# EAGLE design master_control_shield (EAGLE 5.11)
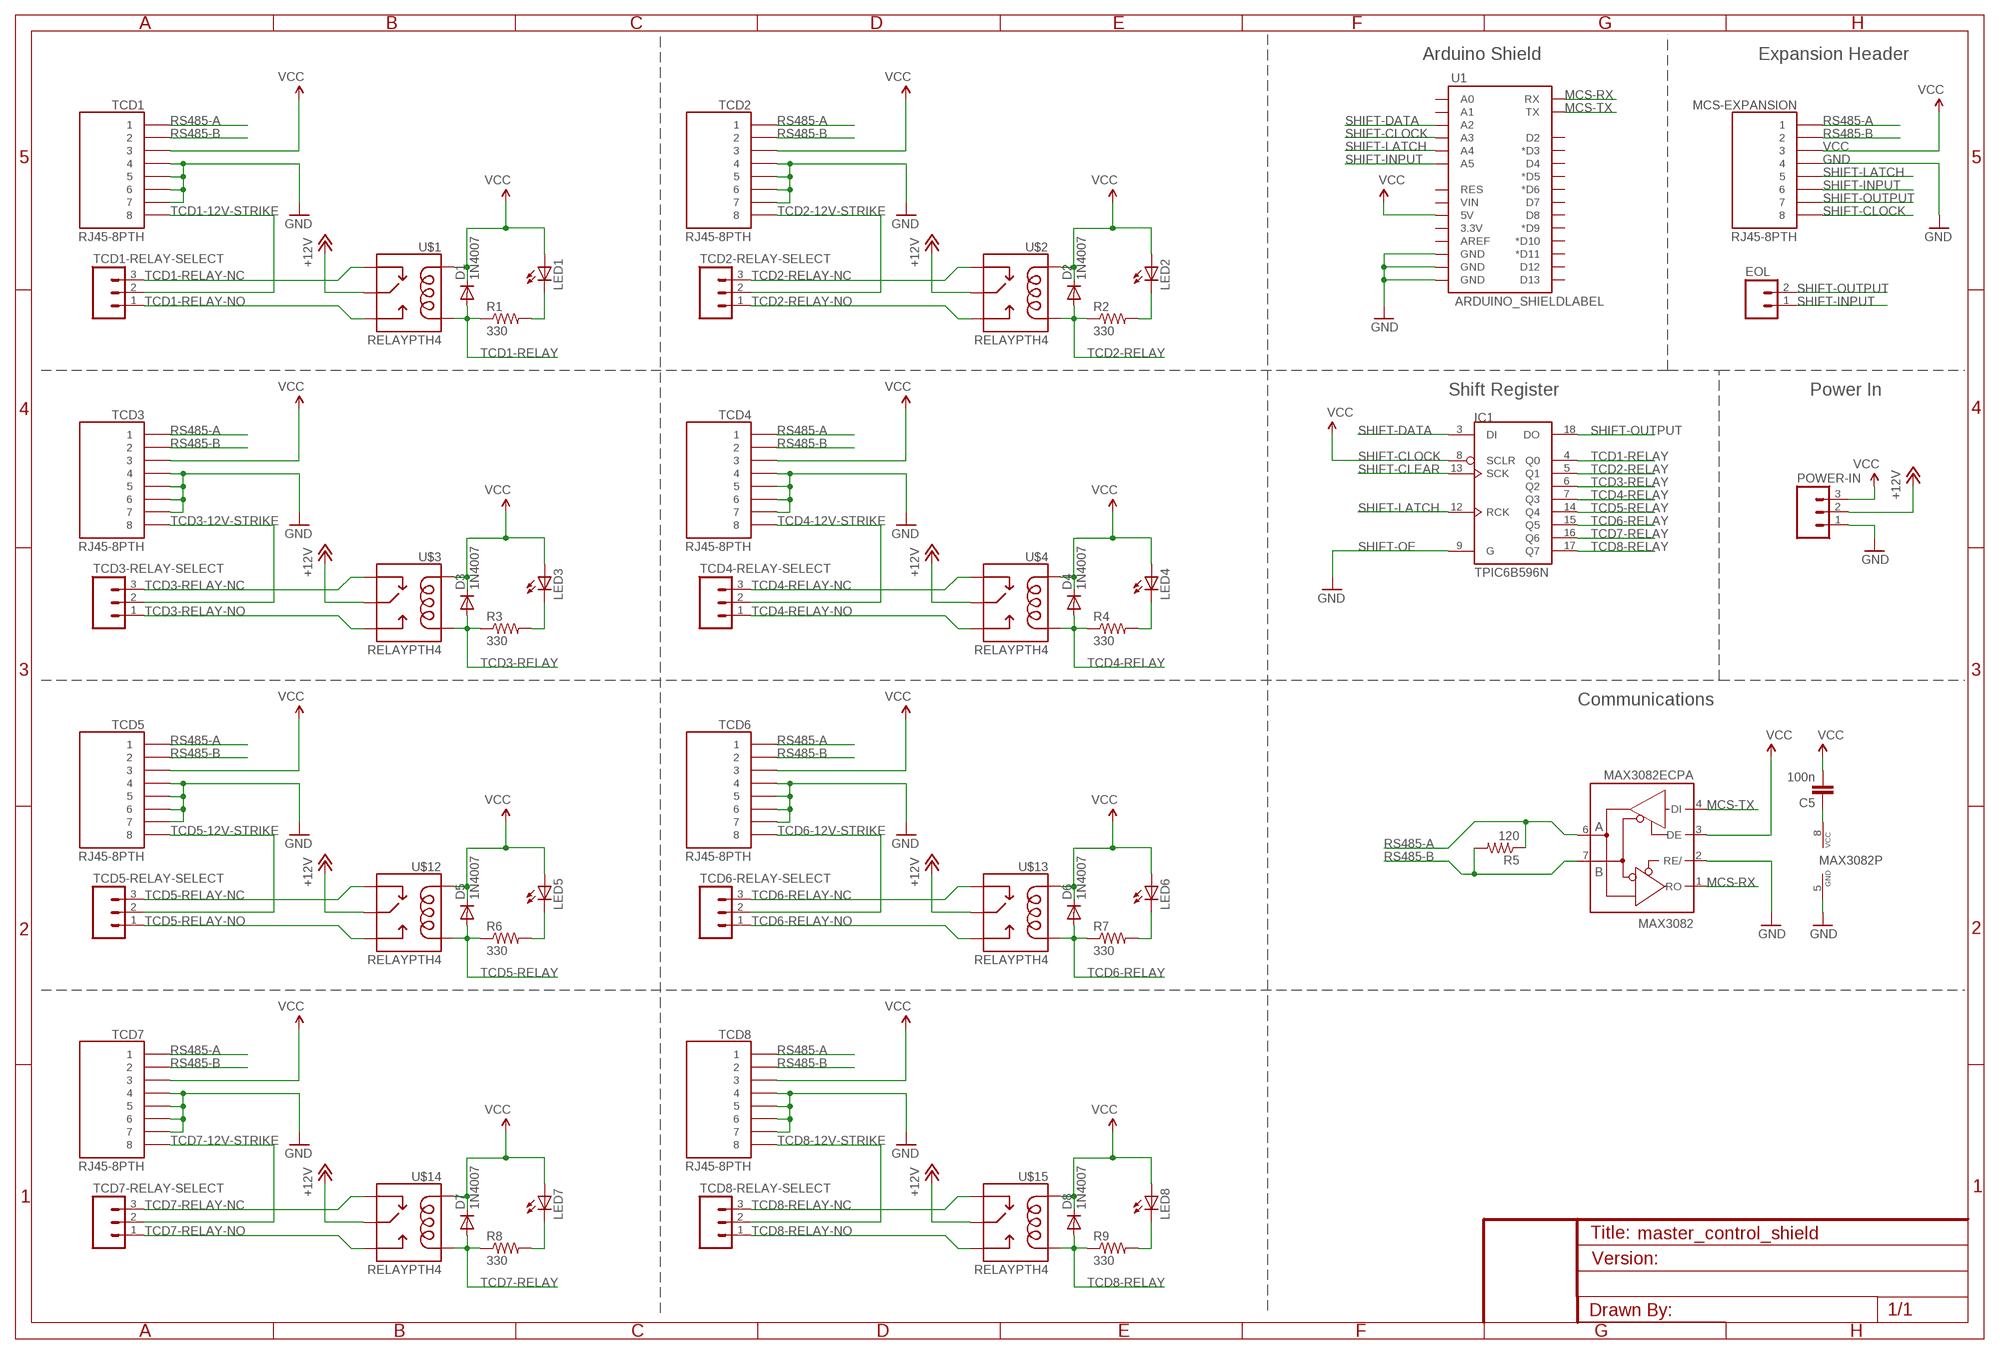
[diagram p0: schematic, sheet 1]

## Parts
C5  100n  CAPPTH  [CAP-PTH-SMALL]
D1  1N4007  DIODEPTH  [DIODE-1N4001]
D2  1N4007  DIODEPTH  [DIODE-1N4001]
D3  1N4007  DIODEPTH  [DIODE-1N4001]
D4  1N4007  DIODEPTH  [DIODE-1N4001]
D5  1N4007  DIODEPTH  [DIODE-1N4001]
D6  1N4007  DIODEPTH  [DIODE-1N4001]
D7  1N4007  DIODEPTH  [DIODE-1N4001]
D8  1N4007  DIODEPTH  [DIODE-1N4001]
EOL  M02PTH  [1X02]
IC1  TPIC6B596N  [DIL20]
LED1  LED5MM  [LED5MM]
LED2  LED5MM  [LED5MM]
LED3  LED5MM  [LED5MM]
LED4  LED5MM  [LED5MM]
LED5  LED5MM  [LED5MM]
LED6  LED5MM  [LED5MM]
LED7  LED5MM  [LED5MM]
LED8  LED5MM  [LED5MM]
MAX3082  MAX3082ECPA  MAX481CPA  [DIL08]
MCS-EXPANSION  RJ45-8PTH  [RJ45-8]
POWER-IN  M03SCREW  [SCREWTERMINAL-3.5MM-3]
R1  330  RESISTORPTH-1/4W  [AXIAL-0.4]
R2  330  RESISTORPTH-1/4W  [AXIAL-0.4]
R3  330  RESISTORPTH-1/4W  [AXIAL-0.4]
R4  330  RESISTORPTH-1/4W  [AXIAL-0.4]
R5  120  RESISTORPTH-1/4W  [AXIAL-0.4]
R6  330  RESISTORPTH-1/4W  [AXIAL-0.4]
R7  330  RESISTORPTH-1/4W  [AXIAL-0.4]
R8  330  RESISTORPTH-1/4W  [AXIAL-0.4]
R9  330  RESISTORPTH-1/4W  [AXIAL-0.4]
TCD1  RJ45-8PTH  [RJ45-8]
TCD1-RELAY-SELECT  M03PTH  [1X03]
TCD2  RJ45-8PTH  [RJ45-8]
TCD2-RELAY-SELECT  M03PTH  [1X03]
TCD3  RJ45-8PTH  [RJ45-8]
TCD3-RELAY-SELECT  M03PTH  [1X03]
TCD4  RJ45-8PTH  [RJ45-8]
TCD4-RELAY-SELECT  M03PTH  [1X03]
TCD5  RJ45-8PTH  [RJ45-8]
TCD5-RELAY-SELECT  M03PTH  [1X03]
TCD6  RJ45-8PTH  [RJ45-8]
TCD6-RELAY-SELECT  M03PTH  [1X03]
TCD7  RJ45-8PTH  [RJ45-8]
TCD7-RELAY-SELECT  M03PTH  [1X03]
TCD8  RJ45-8PTH  [RJ45-8]
TCD8-RELAY-SELECT  M03PTH  [1X03]
U1  ARDUINO_SHIELDLABEL  [DUEMILANOVE_SHIELD]
U$1  RELAYPTH4  [RELAY-JZC]
U$2  RELAYPTH4  [RELAY-JZC]
U$3  RELAYPTH4  [RELAY-JZC]
U$4  RELAYPTH4  [RELAY-JZC]
U$12  RELAYPTH4  [RELAY-JZC]
U$13  RELAYPTH4  [RELAY-JZC]
U$14  RELAYPTH4  [RELAY-JZC]
U$15  RELAYPTH4  [RELAY-JZC]

## Nets
+12V [signal]: POWER-IN.2 U$1.4(MAIN) U$2.4(MAIN) U$3.4(MAIN) U$4.4(MAIN) U$12.4(MAIN) U$13.4(MAIN) U$14.4(MAIN) U$15.4(MAIN)
GND: IC1.9(G) MAX3082.2(RE/) MAX3082.5(GND) MCS-EXPANSION.4 POWER-IN.1 TCD1.4 TCD1.5 TCD1.6 TCD1.7 TCD2.4 TCD2.5 TCD2.6 TCD2.7 TCD3.4 TCD3.5 TCD3.6 TCD3.7 TCD4.4 TCD4.5 TCD4.6 TCD4.7 TCD5.4 TCD5.5 TCD5.6 TCD5.7 TCD6.4 TCD6.5 TCD6.6 TCD6.7 TCD7.4 TCD7.5 TCD7.6 TCD7.7 TCD8.4 TCD8.5 TCD8.6 TCD8.7 U1.GND@0(GND) U1.GND@1(GND) U1.GND@2(GND)
MCS-RX: MAX3082.1(RO) U1.RX
MCS-TX: MAX3082.4(DI) U1.TX
N$1: LED1.K(C) R1.P$2
N$2: LED2.K(C) R2.P$2
N$3: LED3.K(C) R3.P$2
N$4: LED4.K(C) R4.P$2
N$5: LED5.K(C) R6.P$2
N$6: LED6.K(C) R7.P$2
N$7: LED7.K(C) R8.P$2
N$8: LED8.K(C) R9.P$2
N$14: C5.1 MAX3082.8(VCC)
RS485-A: MAX3082.6(A) MCS-EXPANSION.1 R5.P$1 TCD1.1 TCD2.1 TCD3.1 TCD4.1 TCD5.1 TCD6.1 TCD7.1 TCD8.1
RS485-B: MAX3082.7(B) MCS-EXPANSION.2 R5.P$2 TCD1.2 TCD2.2 TCD3.2 TCD4.2 TCD5.2 TCD6.2 TCD7.2 TCD8.2
SHIFT-CLOCK: IC1.13(SCK) MCS-EXPANSION.8 U1.A3
SHIFT-DATA: IC1.3(DI) U1.A2
SHIFT-INPUT: EOL.1 MCS-EXPANSION.6 U1.A5
SHIFT-LATCH: IC1.12(RCK) MCS-EXPANSION.5 U1.A4
SHIFT-OUTPUT: EOL.2 IC1.18(DO) MCS-EXPANSION.7
TCD1-12V-STRIKE: TCD1-RELAY-SELECT.2 TCD1.8
TCD1-RELAY: D1.A IC1.4(Q0) R1.P$1 U$1.1(COIL2)
TCD1-RELAY-NC: TCD1-RELAY-SELECT.3 U$1.2(NC)
TCD1-RELAY-NO: TCD1-RELAY-SELECT.1 U$1.3(NO)
TCD2-12V-STRIKE: TCD2-RELAY-SELECT.2 TCD2.8
TCD2-RELAY: D2.A IC1.5(Q1) R2.P$1 U$2.1(COIL2)
TCD2-RELAY-NC: TCD2-RELAY-SELECT.3 U$2.2(NC)
TCD2-RELAY-NO: TCD2-RELAY-SELECT.1 U$2.3(NO)
TCD3-12V-STRIKE: TCD3-RELAY-SELECT.2 TCD3.8
TCD3-RELAY: D3.A IC1.6(Q2) R3.P$1 U$3.1(COIL2)
TCD3-RELAY-NC: TCD3-RELAY-SELECT.3 U$3.2(NC)
TCD3-RELAY-NO: TCD3-RELAY-SELECT.1 U$3.3(NO)
TCD4-12V-STRIKE: TCD4-RELAY-SELECT.2 TCD4.8
TCD4-RELAY: D4.A IC1.7(Q3) R4.P$1 U$4.1(COIL2)
TCD4-RELAY-NC: TCD4-RELAY-SELECT.3 U$4.2(NC)
TCD4-RELAY-NO: TCD4-RELAY-SELECT.1 U$4.3(NO)
TCD5-12V-STRIKE: TCD5-RELAY-SELECT.2 TCD5.8
TCD5-RELAY: D5.A IC1.14(Q4) R6.P$1 U$12.1(COIL2)
TCD5-RELAY-NC: TCD5-RELAY-SELECT.3 U$12.2(NC)
TCD5-RELAY-NO: TCD5-RELAY-SELECT.1 U$12.3(NO)
TCD6-12V-STRIKE: TCD6-RELAY-SELECT.2 TCD6.8
TCD6-RELAY: D6.A IC1.15(Q5) R7.P$1 U$13.1(COIL2)
TCD6-RELAY-NC: TCD6-RELAY-SELECT.3 U$13.2(NC)
TCD6-RELAY-NO: TCD6-RELAY-SELECT.1 U$13.3(NO)
TCD7-12V-STRIKE: TCD7-RELAY-SELECT.2 TCD7.8
TCD7-RELAY: D7.A IC1.16(Q6) R8.P$1 U$14.1(COIL2)
TCD7-RELAY-NC: TCD7-RELAY-SELECT.3 U$14.2(NC)
TCD7-RELAY-NO: TCD7-RELAY-SELECT.1 U$14.3(NO)
TCD8-12V-STRIKE: TCD8-RELAY-SELECT.2 TCD8.8
TCD8-RELAY: D8.A IC1.17(Q7) R9.P$1 U$15.1(COIL2)
TCD8-RELAY-NC: TCD8-RELAY-SELECT.3 U$15.2(NC)
TCD8-RELAY-NO: TCD8-RELAY-SELECT.1 U$15.3(NO)
VCC: C5.2 D1.C D2.C D3.C D4.C D5.C D6.C D7.C D8.C IC1.8(SCLR) LED1.A LED2.A LED3.A LED4.A LED5.A LED6.A LED7.A LED8.A MAX3082.3(DE) MCS-EXPANSION.3 POWER-IN.3 TCD1.3 TCD2.3 TCD3.3 TCD4.3 TCD5.3 TCD6.3 TCD7.3 TCD8.3 U1.5V U$1.5(COIL1) U$2.5(COIL1) U$3.5(COIL1) U$4.5(COIL1) U$12.5(COIL1) U$13.5(COIL1) U$14.5(COIL1) U$15.5(COIL1)
Unconnected: U1.3.3V U1.A0 U1.A1 U1.AREF U1.D2 U1.D3(*D3) U1.D4 U1.D5(*D5) U1.D6(*D6) U1.D7 U1.D8 U1.D9(*D9) U1.D10(*D10) U1.D11(*D11) U1.D12 U1.D13 U1.RES U1.VIN

## Notes on the sheet
- Arduino Shield | Expansion Header
- Shift Register | Power In
- SHIFT-CLEAR
- SHIFT-OE
- Communications

## Power pins joined to a net without a drawn wire
GND: IC1.10(GND) IC1.11(GND) IC1.19(GND)
VCC: IC1.2(VCC)

## Library data of the parts
C5 = SparkFun:CAP: Capacitor Standard 0603 ceramic capacitor, and 0.1" leaded capacitor.
D1-D8 = SparkFun:DIODE: Diode These are standard reverse protection diodes and small signal diodes. SMA package can handle up to about 1A. SOD-323 can handle about 200mA. What the SOD-323 package when ordering, there are some mfgs out there that are 5-pin packages.
EOL = SparkFun:M02: Header 2 Standard 2-pin 0.1" header. Use with straight break away headers (SKU : PRT-00116), right angle break away headers (PRT-00553), swiss pins (PRT-00743), machine pins (PRT-00117), and female headers (PRT-00115). Molex polarized connector foot print use with SKU : PRT-08233 with associated crimp pins and housings.
IC1 = tpic:TPIC6B596
LED1-LED8 = SparkFun:LED: LEDs Standard schematic elements and footprints for 5mm, 3mm, 1206, and 0603 sized LEDs. 5mm - Spark Fun Electronics SKU : COM-00529 (and others)
MAX3082 = maxim:MAX481CPA: RS485 TRANSEIVER; MPN: MAX481CPA+; OC_FARNELL: unknown; OC_NEWARK: 99K3445
MCS-EXPANSION TCD1-TCD8 = SparkFun:RJ45-8: RJ45 Jack Simple RJ45, 8-pin connection - connector for common Cat5, Cat5e, and Cat6 Ethernet cables. Footprint not yet proven in production. Connector sku is PRT-00643; Breakout PCB sku is BOB-00716.
POWER-IN TCD1-RELAY-SELECT TCD2-RELAY-SELECT TCD3-RELAY-SELECT TCD4-RELAY-SELECT TCD5-RELAY-SELECT TCD6-RELAY-SELECT TCD7-RELAY-SELECT TCD8-RELAY-SELECT = SparkFun:M03: Header 3 Standard 3-pin 0.1" header. Use with straight break away headers (SKU : PRT-00116), right angle break away headers (PRT-00553), swiss pins (PRT-00743), machine pins (PRT-00117), and female headers (PRT-00115). Molex polarized connector foot print use with SKU : PRT-08232 with associated crimp pins and housings.
R1-R9 = SparkFun:RESISTOR: Resistor Basic schematic elements and footprints for 0603, 1206, and PTH resistors.
U1 = SparkFun:ARDUINO_SHIELD
U$1-U$4 U$12-U$15 = SparkFun:RELAY

## Net classes
1 power: width 0.61 mm, clearance 0.406 mm
2 signal: width 0.406 mm, clearance 0.305 mm
3 ground: width 0.406 mm, drill 0.127 mm, clearance 0.254 mm to class 0, clearance 0.254 mm to class 1, clearance 0.254 mm to class 2

## Board
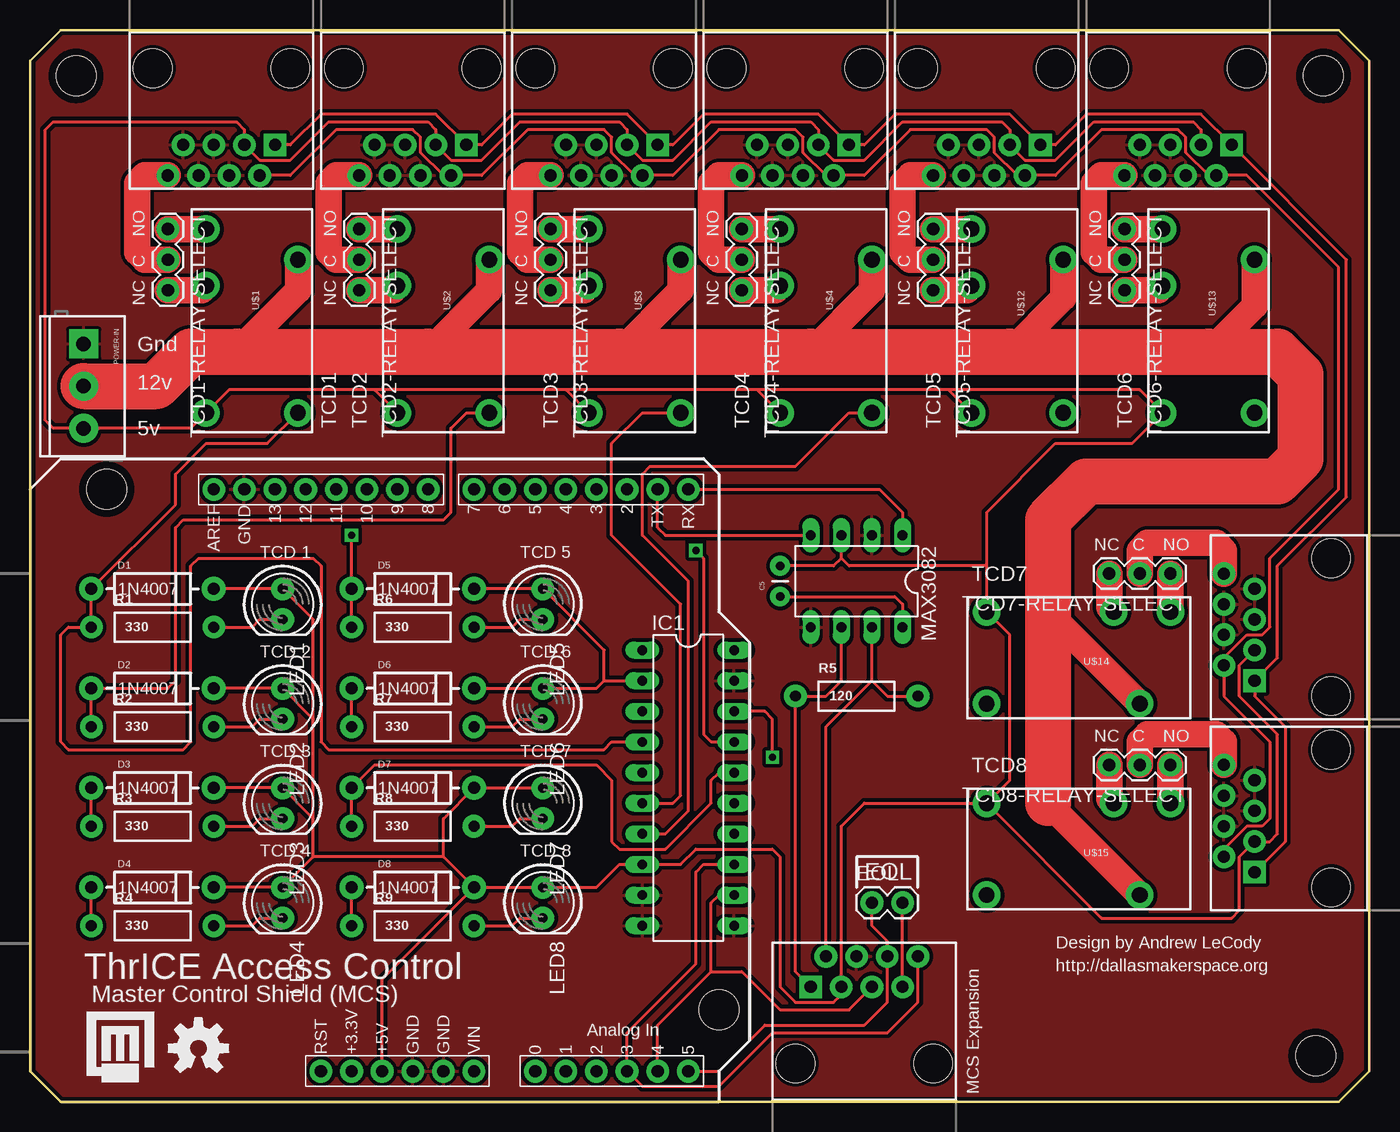
[diagram p1: board, top side]
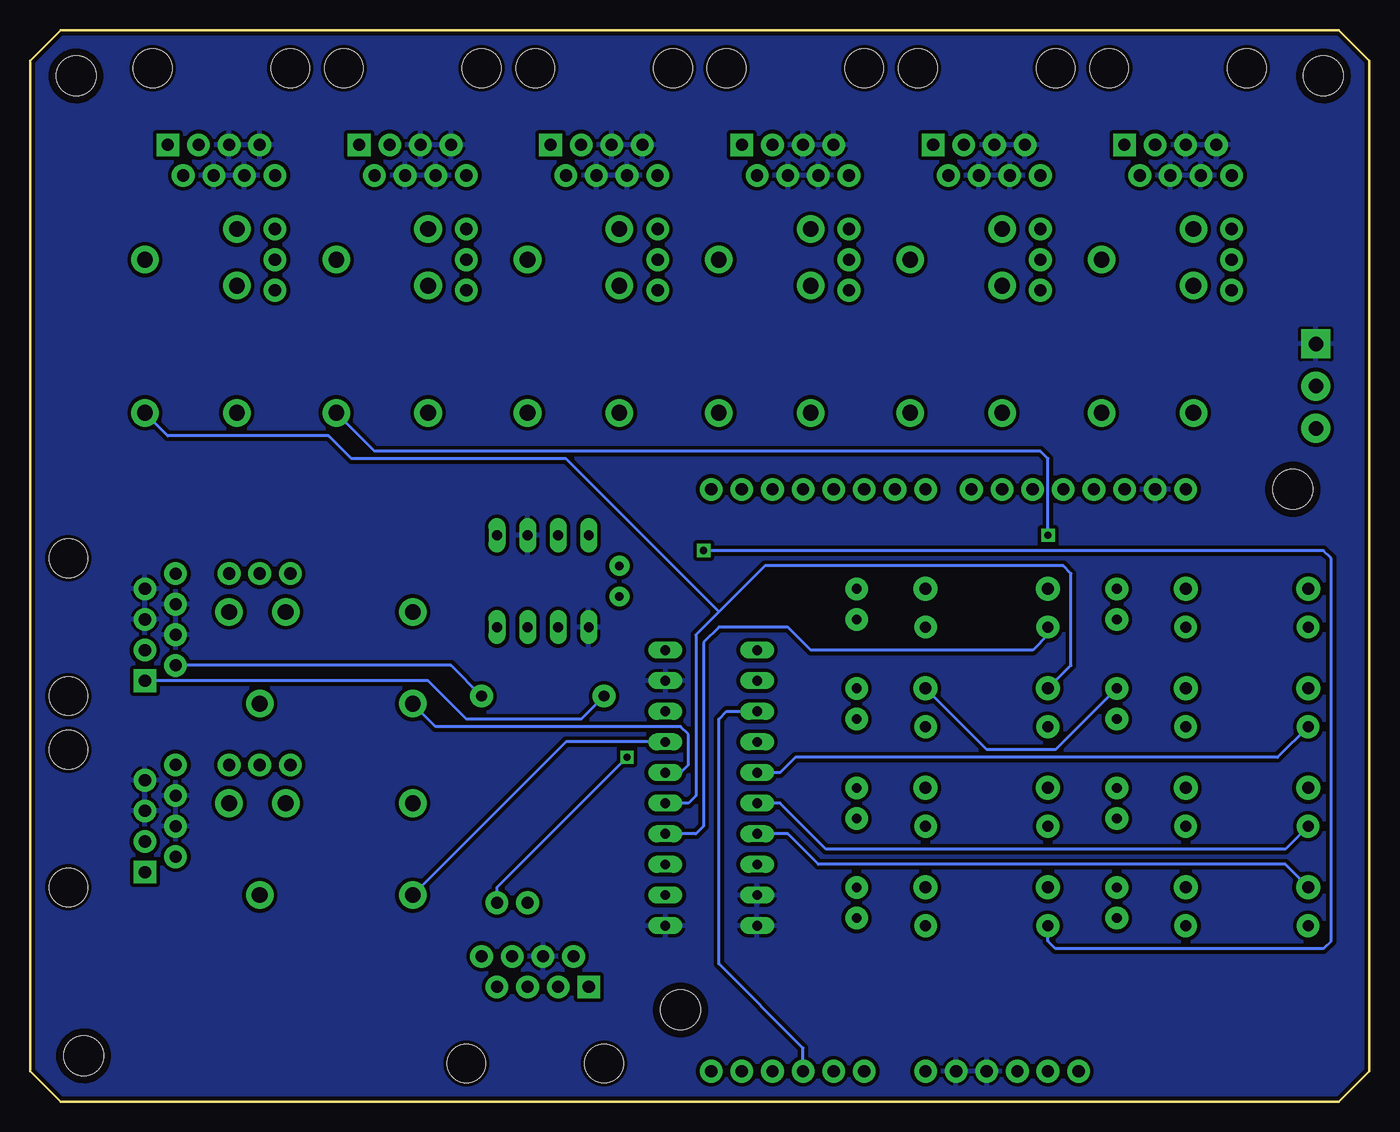
[diagram p2: board, bottom side, seen from below]

Size 111.12 x 88.89 mm. Coordinates in mm from the lower left corner, seen from the top.
Outline: 2.54,0 108.58,0 111.12,2.54 111.12,86.36 108.58,88.89 2.53,88.89 0,86.36 0,2.54 2.54,0
Copper layers (1*16): Top 0.035mm / dielectric 1.5mm / Bottom 0.035mm
Design rules "SparkFun": minimum track width 8mil, minimum drill 20mil, track to track 8mil, track to pad 8mil, pad to pad 8mil, via to via 8mil, smd to smd 8mil, copper to edge 10mil, drill to drill 8mil, minimum pad ring 12mil, minimum via ring 10mil, stop-mask expansion 4mil, vias tented up to drill 25mil, thermal gap 10mil

### Footprints (pad centres in the part's own frame; a part is rotated, then mirrored left to right if it is on the bottom)
CAP-PTH-SMALL = drill 0.7 pad 1.651 round: 1 0,0; 2 2.54,0
DIODE-1N4001 = drill 1 pad 1.981 round: A -5.08,0; C 5.08,0
1X02 = drill 1.016 pad 1.88 round: 1 0,0; 2 2.54,0
DIL20 = drill 0.813 long: 1 -11.43,-3.81; 2 -8.89,-3.81; 3 -6.35,-3.81; 4 -3.81,-3.81; 5 -1.27,-3.81; 6 1.27,-3.81; 7 3.81,-3.81; 8 6.35,-3.81; 9 8.89,-3.81; 10 11.43,-3.81; 11 11.43,3.81; 12 8.89,3.81; 13 6.35,3.81; 14 3.81,3.81; 15 1.27,3.81; 16 -1.27,3.81; 17 -3.81,3.81; 18 -6.35,3.81; 19 -8.89,3.81; 20 -11.43,3.81
LED5MM = drill 0.813 pad 1.88 round: A -1.27,0; K 1.27,0
DIL08 = drill 0.813 long: 1 -3.81,-3.81; 2 -1.27,-3.81; 3 1.27,-3.81; 4 3.81,-3.81; 5 3.81,3.81; 6 1.27,3.81; 7 -1.27,3.81; 8 -3.81,3.81
RJ45-8 = drill 1 pad 1.88 square: 1 -4.445,6.35 | drill 1 pad 1.88 round: 2 -3.175,8.89; 3 -1.905,6.35; 4 -0.635,8.89; 5 0.635,6.35; 6 1.905,8.89; 7 3.175,6.35; 8 4.445,8.89 | hole 3.2: -5.715,0; 5.715,0
SCREWTERMINAL-3.5MM-3 = drill 1.2 pad 2.413 square: 1 0,0 | drill 1.2 pad 2.413 round: 2 3.5,0; 3 7,0
AXIAL-0.4 = drill 0.9 pad 1.88 round: P$1 -5.08,0; P$2 5.08,0
1X03 = drill 1.016 pad 1.88 round: 1 0,0; 2 2.54,0; 3 5.08,0
DUEMILANOVE_SHIELD = drill 1.016 pad 1.88 round: 3.3V 50.8,26.67; 5V 50.8,29.21; A0 50.8,41.91; A1 50.8,44.45; A2 50.8,46.99; A3 50.8,49.53; A4 50.8,52.07; A5 50.8,54.61; AREF 2.54,15.24; D2 2.54,49.53; D3 2.54,46.99; D4 2.54,44.45; D5 2.54,41.91; D6 2.54,39.37; D7 2.54,36.83; D8 2.54,33.02; D9 2.54,30.48; D10 2.54,27.94; D11 2.54,25.4; D12 2.54,22.86; D13 2.54,20.32; GND@0 50.8,31.75; GND@1 50.8,34.29; GND@2 2.54,17.78; RES 50.8,24.13; RX 2.54,54.61; TX 2.54,52.07; VIN 50.8,36.83 | hole 3.302: 45.72,57.15; 2.54,6.35
RELAY-JZC = drill 1.3 pad 2.286 round: 1 3.81,-8.89; 2 -3.81,1.651; 3 -3.81,6.35; 4 3.81,3.81; 5 -3.81,-8.89
STAND-OFF = hole 3.302: 0,0

### Placement (x,y rotation side)
C5  62.23,41.91 90 top
D1  10.16,42.55 0 top
D2  10.16,34.29 0 top
D3  10.16,26.04 0 top
D4  10.16,17.78 0 top
D5  31.75,42.55 0 top
D6  31.75,34.29 0 top
D7  31.75,26.04 0 top
D8  31.75,17.78 0 top
EOL  69.85,16.51 0 top
IC1  54.61,26.04 270 top
LED1  20.95,41.27 270 top
LED2  20.95,33.02 270 top
LED3  20.95,24.77 270 top
LED4  20.95,16.51 270 top
LED5  42.55,41.27 270 top
LED6  42.55,33.02 270 top
LED7  42.55,24.77 270 top
LED8  42.55,16.51 270 top
MAX3082  68.58,43.18 180 top
MCS-EXPANSION  69.22,3.17 0 top
POWER-IN  4.45,62.87 270 top
R1  10.16,39.37 0 top
R2  10.16,31.11 0 top
R3  10.16,22.86 0 top
R4  10.16,14.61 0 top
R5  68.58,33.66 0 top
R6  31.75,39.37 0 top
R7  31.75,31.11 0 top
R8  31.75,22.86 0 top
R9  31.75,14.61 0 top
TCD1  15.88,85.72 180 top
TCD1-RELAY-SELECT  11.43,72.39 270 top
TCD2  31.75,85.72 180 top
TCD2-RELAY-SELECT  27.3,72.39 270 top
TCD3  47.62,85.72 180 top
TCD3-RELAY-SELECT  43.18,72.39 270 top
TCD4  63.5,85.72 180 top
TCD4-RELAY-SELECT  59.05,72.39 270 top
TCD5  79.38,85.72 180 top
TCD5-RELAY-SELECT  74.93,72.39 270 top
TCD6  95.25,85.72 180 top
TCD6-RELAY-SELECT  90.81,72.39 270 top
TCD7  107.95,39.37 90 top
TCD7-RELAY-SELECT  94.61,43.81 180 top
TCD8  107.95,23.5 90 top
TCD8-RELAY-SELECT  94.61,27.94 180 top
U1  0,53.34 270 top
U$1  18.41,66.04 0 top
U$2  34.29,66.04 0 top
U$3  50.16,66.04 0 top
U$4  66.04,66.04 0 top
U$5  [STAND-OFF]  3.81,85.09 0 top
U$6  [STAND-OFF]  107.31,85.09 0 top
U$7  [STAND-OFF]  106.68,3.81 0 top
U$8  [DMS-LOGO]  4.45,1.27 0 top
U$11  [OSHW-LOGO-M]  13.97,4.45 0 top
U$12  81.92,66.04 0 top
U$13  97.79,66.04 0 top
U$14  88.27,36.83 270 top
U$15  88.27,20.95 270 top

### Tracks (layer width: path | path; a pad name or v marks a point on that pad's centre or on a via)
+12V
  Top 2.184: U$13.4 101.6,66.04 97.79,62.23 | U$12.4 85.72,66.67 81.28,62.23 | U$1.4 22.23,67.31 17.14,62.23 | U$4.4 69.85,67.31 64.77,62.23 | U$3.4 53.98,67.31 48.9,62.23 | U$2.4 38.1,67.31 33.02,62.23 | 84.45,24.77 U$15.4 | 84.45,40.64 U$14.4
  Top 3.81: POWER-IN.2 10.47,59.37 13.34,62.23 17.14,62.23 33.02,62.23 48.9,62.23 64.77,62.23 81.28,62.23 97.79,62.23 103.5,62.23 105.41,60.33 105.41,53.34 103.5,51.44 87.63,51.44 84.45,48.26 84.45,40.64 84.45,24.77
GND
  pour Bottom (isolate 0.305): -1.91,90.81 113.03,90.81 113.03,-1.91 -1.91,-1.91
  pour Top (isolate 0.305): -3.81,92.71 115.57,92.71 115.57,-3.81 -3.81,-3.81
MCS-RX
  Top 0.254: MAX3082.1 72.39,48.9 70.48,50.8 U1.RX
MCS-TX
  Top 0.254: MAX3082.4 52.7,46.99 52.07,47.62 U1.TX
N$1
  Top 0.254: LED1.K 19.05,40.01 18.41,39.37 R1.P$2
N$2
  Top 0.254: LED2.K 19.05,31.75 18.41,31.11 R2.P$2
N$3
  Top 0.254: LED3.K 19.05,23.5 18.41,22.86 R3.P$2
N$4
  Top 0.254: LED4.K 19.05,15.24 18.41,14.61 R4.P$2
N$5
  Top 0.254: LED5.K 40.64,40.01 40.01,39.37 R6.P$2
N$6
  Top 0.254: LED6.K 40.64,31.75 40.01,31.11 R7.P$2
N$7
  Top 0.254: LED7.K 40.64,23.5 40.01,22.86 R8.P$2
N$8
  Top 0.254: LED8.K 40.64,15.24 40.01,14.61 R9.P$2
N$14
  Top 0.254: C5.1 71.75,41.91 72.39,41.27 MAX3082.8
RS485-A
  Top 0.254: MAX3082.6 67.31,34.92 66.04,33.66 R5.P$1 63.5,10.79 MCS-EXPANSION.1 | TCD1.1 21.59,79.38 24.13,81.92 33.66,81.92 TCD2.1 37.47,79.38 40.01,81.92 49.53,81.92 TCD3.1 53.34,79.38 55.88,81.92 65.41,81.92 TCD4.1 69.22,79.38 71.75,81.92 81.28,81.92 TCD5.1 85.09,79.38 87.63,81.92 97.16,81.92 TCD6.1 109.22,69.85 109.22,50.16 103.5,44.45 103.5,36.83 TCD7.1 101.6,33.66 104.14,31.11 104.14,21.59 TCD8.1
  Bottom 0.254: TCD7.1 78.11,34.92 74.93,31.75 65.41,31.75 R5.P$1
RS485-B
  Top 0.254: 69.85,34.92 MAX3082.7 | TCD1.2 21.59,76.83 25.4,80.64 31.75,80.64 32.38,80.01 32.38,78.74 34.29,76.83 TCD2.2 37.47,76.83 41.27,80.64 47.62,80.64 48.26,80.01 48.26,78.74 50.16,76.83 TCD3.2 53.34,76.83 57.15,80.64 63.5,80.64 64.14,80.01 64.14,78.74 66.04,76.83 TCD4.2 69.22,76.83 73.03,80.64 79.38,80.64 80.01,80.01 80.01,78.74 81.92,76.83 TCD5.2 85.09,76.83 88.9,80.64 95.25,80.64 95.89,80.01 95.89,78.74 97.79,76.83 TCD6.2 100.97,76.83 108.58,69.22 108.58,50.8 102.87,45.09 102.87,39.37 102.23,38.73 100.97,38.73 99.06,36.83 TCD7.2 99.06,33.66 102.87,29.84 102.87,23.5 102.23,22.86 100.97,22.86 99.06,20.95 TCD8.2 | MCS-EXPANSION.2 66.04,31.11 69.85,34.92 | R5.P$2 71.12,33.66 69.85,34.92
  Bottom 0.254: R5.P$2 76.2,36.2 TCD7.2
SHIFT-CLOCK
  Top 0.254: IC1.13 55.88,19.68 55.24,19.05 55.24,11.43 49.53,5.71 U1.A3 50.8,1.27 57.15,1.27 61.59,5.71 71.12,5.71 73.66,8.26 MCS-EXPANSION.8
SHIFT-DATA
  Bottom 0.254: U1.A2 46.99,4.45 53.98,11.43 53.98,31.75 53.34,32.38 IC1.3
SHIFT-INPUT
  Top 0.254: U1.A5 57.15,2.54 60.96,6.35 69.22,6.35 71.12,8.26 MCS-EXPANSION.6 71.12,13.34 69.85,14.61 EOL.1
SHIFT-LATCH
  Top 0.254: U1.A4 52.07,6.35 56.52,10.79 | 56.52,10.79 59.05,10.79 62.23,7.62 67.94,7.62 MCS-EXPANSION.5 | IC1.12 57.15,17.14 56.52,16.51 56.52,10.79
SHIFT-OUTPUT  (via drill 0.6)
  Top 0.254: MCS-EXPANSION.7 EOL.2 | v61.59,28.57 61.59,31.75 60.96,32.38 IC1.18
  Bottom 0.254: EOL.2 72.39,17.78 v61.59,28.57
TCD1-12V-STRIKE
  Top 2.184: TCD1-RELAY-SELECT.2 9.53,69.85 8.89,70.48 8.89,76.2 9.53,76.83 TCD1.8
TCD1-RELAY
  Top 0.254: U$1.1 19.68,54.61 14.61,54.61 12.06,52.07 12.06,49.53 D1.A R1.P$1 3.17,39.37 2.54,38.73 2.54,29.84 3.17,29.21 12.7,29.21 13.34,29.84 13.34,44.45 13.97,45.09 23.5,45.09 24.13,44.45 24.13,29.84 24.77,29.21 47.62,29.21 48.26,29.84 IC1.4
TCD1-RELAY-NC
  Top 2.184: TCD1-RELAY-SELECT.3 14.22,67.31 U$1.2
TCD1-RELAY-NO
  Top 2.184: TCD1-RELAY-SELECT.1 U$1.3
TCD2-12V-STRIKE
  Top 2.184: TCD2-RELAY-SELECT.2 25.4,69.85 24.77,70.48 24.77,76.2 25.4,76.83 TCD2.8
TCD2-RELAY
  Top 0.254: R2.P$1 D2.A 11.43,34.29 12.06,34.92 12.06,47.62 12.7,48.26 34.29,48.26 34.92,48.9 34.92,55.88 36.2,57.15 U$2.1
  Bottom 0.254: IC1.5 48.9,27.3 47.62,28.57 7.62,28.57 R2.P$1
TCD2-RELAY-NC
  Top 2.184: TCD2-RELAY-SELECT.3 30.1,67.31 U$2.2
TCD2-RELAY-NO
  Top 2.184: TCD2-RELAY-SELECT.1 U$2.3
TCD3-12V-STRIKE
  Top 2.184: TCD3-RELAY-SELECT.2 41.27,69.85 40.64,70.48 40.64,76.2 41.27,76.83 TCD3.8
TCD3-RELAY
  Top 0.254: R3.P$1 D3.A | IC1.6 53.34,24.77 53.98,25.4 53.98,41.27 48.26,46.99 48.26,54.61 50.8,57.15 U$3.1
  Bottom 0.254: IC1.6 48.9,24.77 45.09,20.95 6.99,20.95 R3.P$1
TCD3-RELAY-NC
  Top 2.184: TCD3-RELAY-SELECT.3 45.97,67.31 U$3.2
TCD3-RELAY-NO
  Top 2.184: TCD3-RELAY-SELECT.1 U$3.3
TCD4-12V-STRIKE
  Top 2.184: TCD4-RELAY-SELECT.2 57.15,69.85 56.52,70.48 56.52,76.2 57.15,76.83 TCD4.8
TCD4-RELAY
  Top 0.254: R4.P$1 D4.A | IC1.7 52.7,22.23 54.61,24.13 54.61,43.18 50.8,46.99 50.8,52.07 51.44,52.7 63.5,52.7 67.94,57.15 U$4.1
  Bottom 0.254: IC1.7 48.26,22.23 45.72,19.68 6.99,19.68 D4.A
TCD4-RELAY-NC
  Top 2.184: TCD4-RELAY-SELECT.3 61.85,67.31 U$4.2
TCD4-RELAY-NO
  Top 2.184: TCD4-RELAY-SELECT.1 U$4.3
TCD5-12V-STRIKE
  Top 2.184: TCD5-RELAY-SELECT.2 73.03,69.85 72.39,70.48 72.39,76.2 73.03,76.83 TCD5.8
TCD5-RELAY  (via drill 0.6)
  Top 0.254: R6.P$1 D5.A v26.67,46.99
  Bottom 0.254: R6.P$1 26.67,38.73 27.94,37.47 46.35,37.47 48.26,39.37 53.98,39.37 55.24,38.1 55.24,22.86 55.88,22.23 IC1.14 | v26.67,46.99 26.67,53.34 27.3,53.98 82.55,53.98 U$12.1
TCD5-RELAY-NC
  Top 2.184: TCD5-RELAY-SELECT.3 77.72,67.31 U$12.2
TCD5-RELAY-NO
  Top 2.184: TCD5-RELAY-SELECT.1 U$12.3
TCD6-12V-STRIKE
  Top 2.184: TCD6-RELAY-SELECT.2 88.9,69.85 88.27,70.48 88.27,76.2 88.9,76.83 TCD6.8
TCD6-RELAY
  Top 0.254: R7.P$1 D6.A
  Bottom 0.254: IC1.15 56.52,24.77 55.88,25.4 55.88,38.73 53.98,40.64 | 53.98,40.64 50.16,44.45 25.4,44.45 24.77,43.81 24.77,36.2 D6.A | 53.98,40.64 66.67,53.34 84.45,53.34 86.36,55.24 99.69,55.24 U$13.1
TCD6-RELAY-NC
  Top 2.184: TCD6-RELAY-SELECT.3 93.6,67.31 U$13.2
TCD6-RELAY-NO
  Top 2.184: TCD6-RELAY-SELECT.1 U$13.3
TCD7-12V-STRIKE
  Top 2.184: TCD7-RELAY-SELECT.2 92.08,45.72 92.71,46.35 98.42,46.35 99.06,45.72 TCD7.8
TCD7-RELAY
  Top 0.254: R8.P$1 D7.A 28.57,27.94 46.99,27.94 48.26,26.67 48.26,21.59 48.9,20.95 52.7,20.95 56.52,24.77 56.52,26.67 57.15,27.3 IC1.16
  Bottom 0.254: U$14.1 77.47,31.11 57.15,31.11 56.52,30.48 56.52,27.94 57.15,27.3 IC1.16
TCD7-RELAY-NC
  Top 2.184: TCD7-RELAY-SELECT.3 89.53,41.02 U$14.2
TCD7-RELAY-NO
  Top 2.184: U$14.3 TCD7-RELAY-SELECT.1
TCD8-12V-STRIKE
  Top 2.184: TCD8-RELAY-SELECT.2 92.08,29.84 92.71,30.48 98.42,30.48 99.06,29.84 TCD8.8
TCD8-RELAY  (via drill 0.6)
  Top 0.254: R9.P$1 D8.A | IC1.17 56.52,29.84 55.88,30.48 55.88,45.09 v55.24,45.72
  Bottom 0.254: U$15.1 66.67,29.84 IC1.17 | v55.24,45.72 3.81,45.72 3.17,45.09 3.17,13.34 3.81,12.7 26.04,12.7 26.67,13.34 R9.P$1
TCD8-RELAY-NC
  Top 2.184: TCD8-RELAY-SELECT.3 89.53,25.15 U$15.2
TCD8-RELAY-NO
  Top 2.184: U$15.3 TCD8-RELAY-SELECT.1
VCC
  Top 0.254: TCD6.3 97.16,80.64 96.52,81.28 88.27,81.28 85.09,78.11 82.55,78.11 TCD5.3 81.28,80.64 80.64,81.28 72.39,81.28 69.22,78.11 66.67,78.11 TCD4.3 65.41,80.64 64.77,81.28 56.52,81.28 53.34,78.11 50.8,78.11 TCD3.3 49.53,80.64 48.9,81.28 40.64,81.28 37.47,78.11 34.92,78.11 TCD2.3 33.66,80.64 33.02,81.28 24.77,81.28 21.59,78.11 19.05,78.11 TCD1.3 17.78,80.64 17.14,81.28 1.91,81.28 1.27,80.64 1.27,56.52 1.91,55.88 4.43,55.88 POWER-IN.3 | POWER-IN.3 5.73,55.87 | D8.C LED8.A 46.99,17.78 48.9,19.68 IC1.8 53.98,19.68 55.24,20.95 61.59,20.95 62.23,20.32 62.23,9.53 63.5,8.26 66.67,8.26 67.31,8.89 MCS-EXPANSION.3 67.31,22.86 69.22,24.77 U$15.5 | D8.C 29.21,10.16 U1.5V | 23.5,20.32 LED4.A D4.C | 34.29,20.32 23.5,20.32 | D8.C 34.29,20.32 | 23.5,20.32 23.5,23.5 | 23.5,23.5 LED3.A D3.C | 34.29,20.32 34.29,23.5 D7.C LED7.A | 23.5,23.5 23.5,31.75 | D2.C LED2.A 23.5,31.75 | 47.62,34.92 46.99,34.29 LED6.A D6.C | 47.62,34.92 IC1.2 | 23.5,31.75 23.5,40.01 LED1.A D1.C | D5.C LED5.A 47.62,37.47 47.62,34.92 | POWER-IN.3 13.32,55.87 U$1.5 16.51,59.05 28.57,59.05 | U$15.5 81.28,26.67 81.28,38.73 U$14.5 79.38,44.45 | 60.33,59.05 U$4.5 | 44.45,59.05 28.57,59.05 | 60.33,59.05 44.45,59.05 | 28.57,59.05 U$2.5 | 44.45,59.05 U$3.5 | 76.2,59.05 U$12.5 | 76.2,59.05 60.33,59.05 | 76.2,59.05 92.08,59.05 U$13.5 91.44,54.61 85.09,54.61 79.38,48.9 79.38,44.45 | U$15.5 88.9,15.24 99.69,15.24 100.33,15.88 100.33,20.32 TCD8.3 102.87,21.59 103.5,22.23 103.5,30.48 100.33,33.66 100.33,36.2 TCD7.3 | C5.2 66.67,44.45 67.31,45.09 | 67.31,45.09 MAX3082.3 | 67.31,45.09 67.94,44.45 79.38,44.45
  Bottom 0.254: D6.C 31.75,29.21 26.04,29.21 LED2.A

### Text on the board
tPlace: NO | NO | NO | NO | NO | NO | C | C | C | C | C | C | NC | NC | NC | NC | NC | NC | Gnd | 12v | TCD1 | TCD2 | TCD3 | TCD4 | TCD5 | TCD6 | 5v | NC | C | NO | TCD 1 | TCD 5 | TCD7 | TCD 2 | TCD 6 | NC | C | NO | TCD 3 | TCD 7 | TCD8 | TCD 4 | TCD 8 | EOL | Design by Andrew LeCody | http://dallasmakerspace.org | ThrICE Access Control | Master Control Shield (MCS) | MCS Expansion